# EAGLE design Qwiic_OLED_Breakout (EAGLE 9.6.2)
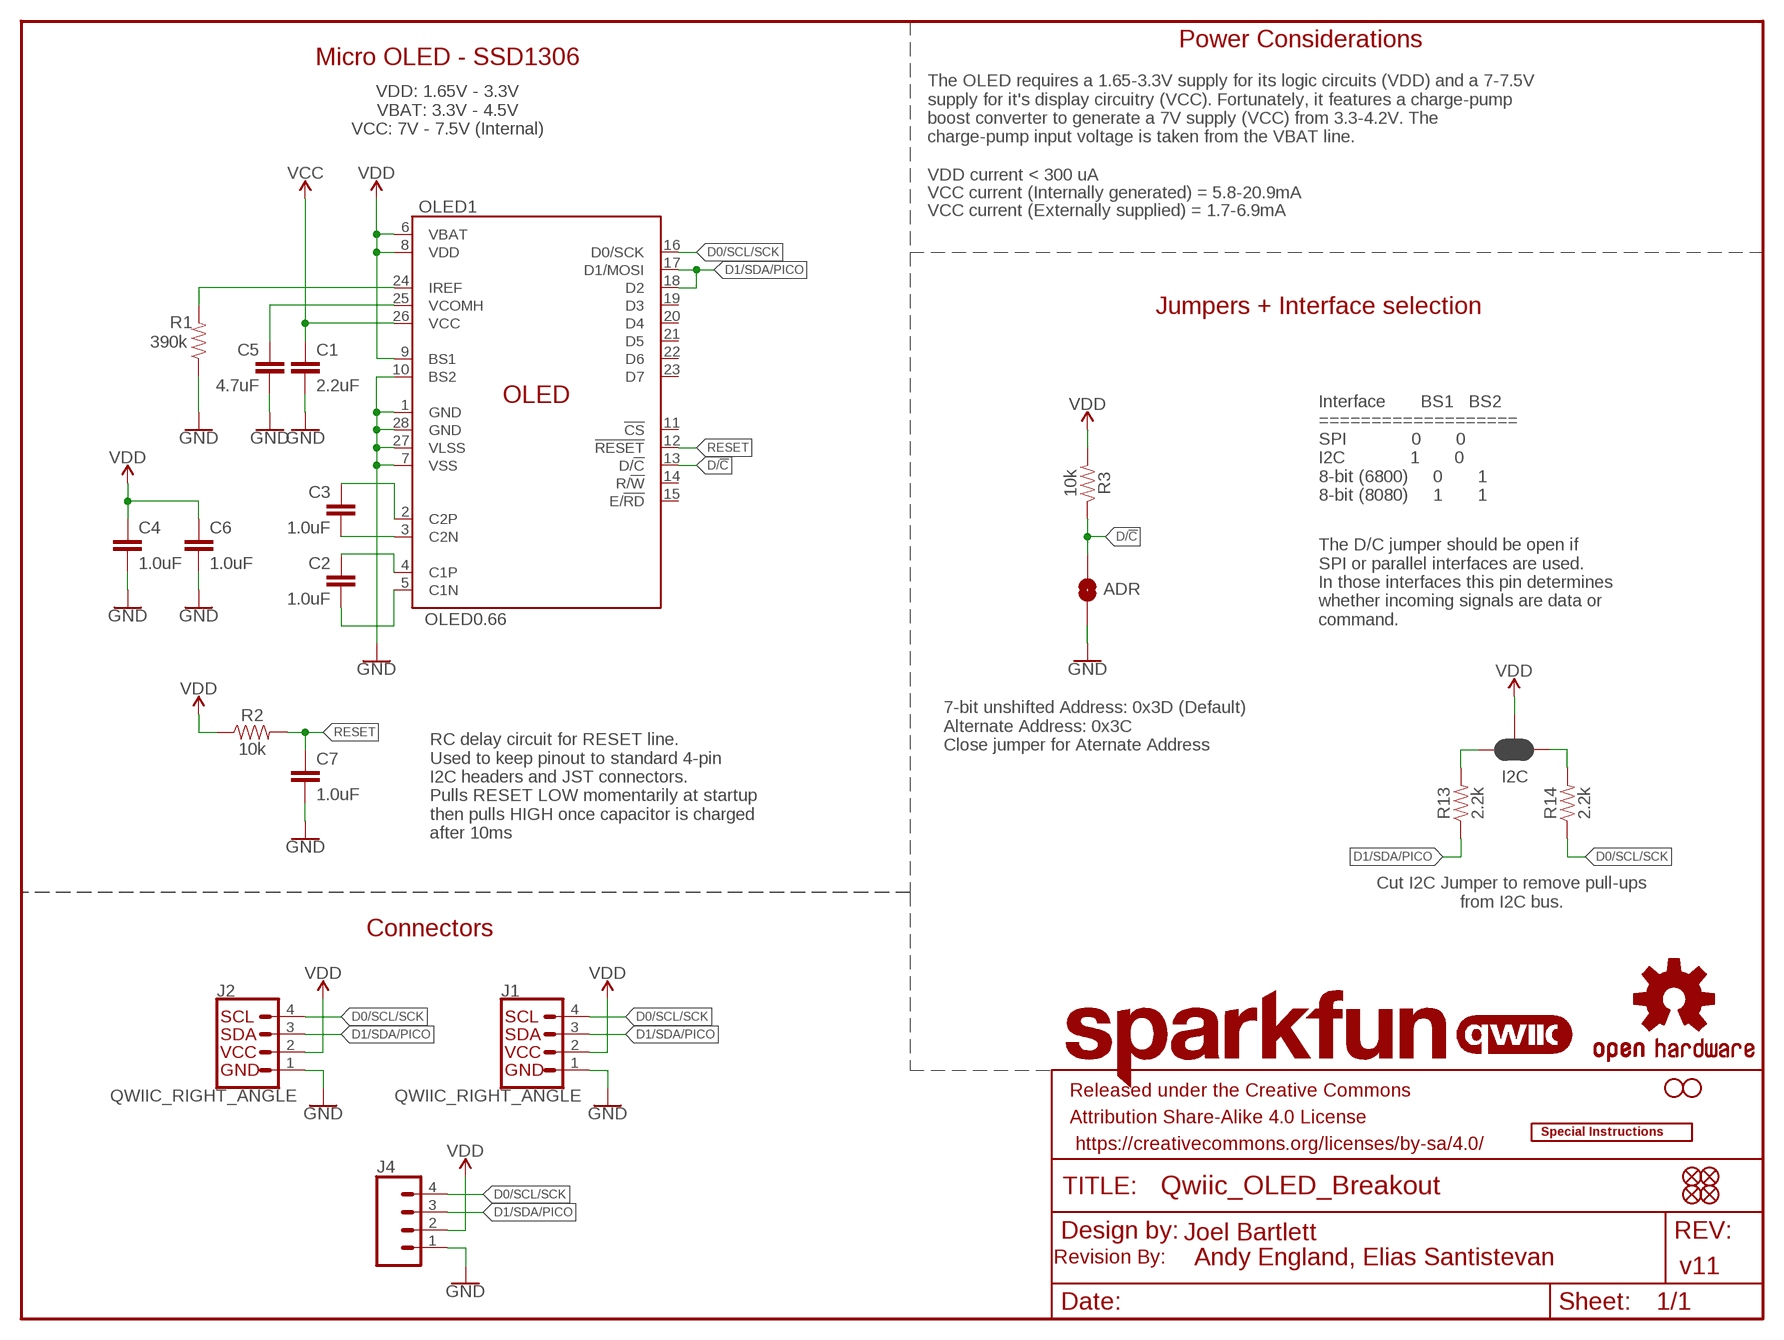
[diagram p0: schematic, sheet 1]

## Parts
ADR  JUMPER-SMT_2_NO_SILK  [SMT-JUMPER_2_NO_SILK]
C1  2.2uF  2.2UF-0805-25V-(+80/-20%)  [0805]
C2  1.0uF  1.0UF-0805-25V-10%  [0805]
C3  1.0uF  1.0UF-0805-25V-10%  [0805]
C4  1.0uF  1.0UF-0603-16V-10%  [0603]
C5  4.7uF  4.7UF-1206-16V-(+80/-20%)  [1206]
C6  1.0uF  1.0UF-0603-16V-10%  [0603]
C7  1.0uF  1.0UF-0603-16V-10%  [0603]
FID1  FIDUCIAL1X2  [FIDUCIAL-1X2]
FID2  FIDUCIAL1X2  [FIDUCIAL-1X2]
FID3  FIDUCIAL1X2  [FIDUCIAL-1X2]
FID4  FIDUCIAL1X2  [FIDUCIAL-1X2]
FRAME1  FRAME-LETTER  [CREATIVE_COMMONS]
H1  STAND-OFF  [STAND-OFF]
H2  STAND-OFF  [STAND-OFF]
I2C  JUMPER-SMT_3_2-NC_PASTE_SILK  [SMT-JUMPER_3_2-NC_PASTE_SILK]
J1  QWIIC_RIGHT_ANGLE  QWIIC_CONNECTORJS-1MM  [JST04_1MM_RA]
J2  QWIIC_RIGHT_ANGLE  QWIIC_CONNECTORJS-1MM  [JST04_1MM_RA]
J4  CONN_041X04_NO_SILK_NO_POP  [1X04_NO_SILK]
LOGO2  SFE_LOGO_NAME.1_INCH  [SFE_LOGO_NAME_.1]
LOGO3  OSHW-LOGOS  [OSHW-LOGO-S]
LOGO5  QWIIC_LOGO_4MM  [QWIIC_4MM]
LOGO6  SPECIAL_INSTRUCTIONS-ORDERING  [ORDERING_INSTRUCTIONS]
OLED1  OLED0.66  [OLED-0.66-64X48]
R1  390k  390KOHM-0603-1/10W-1%  [0603]
R2  10k  10KOHM-0603-1/10W-1%  [0603]
R3  10k  10KOHM-0603-1/10W-1%  [0603]
R13  2.2k  2.2KOHM-0603-1/10W-1%  [0603]
R14  2.2k  2.2KOHM-0603-1/10W-1%  [0603]

## Nets
C1P: C2.1 OLED1.4(C1P)
C2N: C3.2 OLED1.3(C2N)
D0/SCL/SCK: J1.4 J2.4 J4.4 OLED1.16(D0/SCK) R14.1
D1/SDA/PICO: J1.3 J2.3 J4.3 OLED1.17(D1/MOSI) OLED1.18(D2) R13.1
D/!C!: ADR.2 OLED1.13(D/!C!) R3.1
GND: ADR.1 C1.2 C4.2 C5.2 C6.2 C7.2 J1.1 J2.1 J4.1 OLED1.1(GND) OLED1.7(VSS) OLED1.10(BS2) OLED1.27(VLSS) OLED1.28(GND) R1.1
IREF: OLED1.24(IREF) R1.2
N$1: C3.1 OLED1.2(C2P)
N$2: C2.2 OLED1.5(C1N)
N$4: I2C.3 R13.2
N$5: I2C.1 R14.2
RESET: C7.1 OLED1.12(!RESET!) R2.2
VCC: C1.1 OLED1.26(VCC)
VCOMH: C5.1 OLED1.25(VCOMH)
VDD: C4.1 C6.1 I2C.2 J1.2 J2.2 J4.2 OLED1.6(VBAT) OLED1.8(VDD) OLED1.9(BS1) R2.1 R3.2
Unconnected: OLED1.11(!CS!) OLED1.14(R/!W!) OLED1.15(E/!RD!) OLED1.19(D3) OLED1.20(D4) OLED1.21(D5) OLED1.22(D6) OLED1.23(D7)

## Notes on the sheet
- Power Considerations
- Micro OLED - SSD1306
- The OLED requires a 1.65-3.3V supply for its logic circuits (VDD) and a 7-7.5V
  supply for it's display circuitry (VCC). Fortunately, it features a charge-pump 
  boost converter to generate a 7V supply (VCC) from 3.3-4.2V. The 
  charge-pump input voltage is taken from the VBAT line.
- VDD: 1.65V - 3.3V
  VBAT: 3.3V - 4.5V
  VCC: 7V - 7.5V (Internal)
- VDD current < 300 uA
- VCC current (Internally generated) = 5.8-20.9mA
- VCC current (Externally supplied) = 1.7-6.9mA
- Jumpers + Interface selection
- Interface       BS1   BS2
  ===================
  SPI             0       0
  I2C             1       0
  8-bit (6800)     0       1
  8-bit (8080)     1       1
- The D/C jumper should be open if
  SPI or parallel interfaces are used.
  In those interfaces this pin determines
  whether incoming signals are data or
  command.
- 7-bit unshifted Address: 0x3D (Default)
  Alternate Address: 0x3C
  Close jumper for Aternate Address
- RC delay circuit for RESET line. 
  Used to keep pinout to standard 4-pin
  I2C headers and JST connectors. 
  Pulls RESET LOW momentarily at startup
  then pulls HIGH once capacitor is charged
  after 10ms
- Cut I2C Jumper to remove pull-ups 
  from I2C bus.
- Connectors
- Joel Bartlett
- Revision By: | Andy England, Elias Santistevan
- v11

## Library data of the parts
ADR = SparkFun-Jumpers:JUMPER-SMT_2_NO: Normally open jumper This jumper has two pads in close proximity to each other. Apply solder to close the connection. Round pads are easier to solder for beginners, but are a lot larger. SparkFun Product that uses the round pads: SparkFun EL Sequencer <https://www.sparkfun.com/products/12781>
C1 = SparkFun-Capacitors:2.2UF: 2.2µF ceramic capacitors A capacitor is a passive two-terminal electrical component used to store electrical energy temporarily in an electric field.; PROD_ID: CAP-11624
C2 C3 = SparkFun-Capacitors:1.0UF: 1µF ceramic capacitors A capacitor is a passive two-terminal electrical component used to store electrical energy temporarily in an electric field.; PROD_ID: CAP-08064
C4 C6 C7 = SparkFun-Capacitors:1.0UF: 1µF ceramic capacitors A capacitor is a passive two-terminal electrical component used to store electrical energy temporarily in an electric field.; PROD_ID: CAP-00868
C5 = SparkFun-Capacitors:4.7UF: 4.7µF ceramic capacitors A capacitor is a passive two-terminal electrical component used to store electrical energy temporarily in an electric field.; PROD_ID: CAP-10300
FID1-FID4 = SparkFun-Aesthetics:FIDUCIAL: Fiducial Alignment Points Point-of-reference for pick-and-place machines and other optical instruments.
FRAME1 = SparkFun-Aesthetics:FRAME-LETTER: Schematic Frame - Letter Standard 8.5x11 US Letter frame
H1 H2 = SparkFun-Hardware:STAND-OFF: Stand Off Drill holes for mechanically mounting via screws, standoffs, etc. Note: Use the keepout ring to avoid running the screw head into surrounding components. Variant Overviews STAND-OFF - Mechanical footprint for a #4 phillips button head screw. STAND-OFF-TIGHT - Mechanical footprint for a #4 phillips button head screw, Example SparkFun Products Screw - Phillips Head (1/4", 4-40, 10 pack) <https://www.sparkfun.com/products/10453> (PRT-10453) Screw - Phillips Head (1/2", 4-40, 10 pack) <https://www.sparkfun.com/products/10452> (PRT-10452) Screw - Phillips Head (3/4", 4-40, 10 pack) <https://www.sparkfun.com/products/10451> (PRT-10451) Screw - Phillips Head (1", 4-40, 10 pack) <https://www.sparkfun.com/products/10450> (PRT-10450)
I2C = SparkFun-Jumpers:JUMPER-SMT_3_2-NC_PASTE: Normally closed solder jumper (2 of 2 connections) This jumper has an aperture in the stencil to allow solder paste to bridge both connections. Both connections are normally closed (NC). Wick off the solder to open the connection(s). Reapply solder to reclose the connection(s).
J1 J2 = SparkFun-Connectors:QWIIC_CONNECTOR: SparkFun I2C Standard Qwiic Connector An SMD 1mm pitch JST connector makes it easy and quick (get it? Qwiic?) to connect I2C devices to each other. The Qwiic system <http://www.sparkfun.com/qwiic> enables fast and solderless connection between popular platforms and various sensors and actuators. We carry 200mm <https://www.sparkfun.com/products/14204>, 100mm <https://www.sparkfun.com/products/14205>, 50mm <https://www.sparkfun.com/products/14206>, and breadboard friendly <https://www.sparkfun.com/products/14207> Qwiic cables. We also offer 10 pcs strips <https://www.sparkfun.com/products/14323> the SMD connectors.; PROD_ID: CONN-13694
J4 = SparkFun-Connectors:CONN_04: Multi connection point. Often used as Generic Header-pin footprint for 0.1 inch spaced/style header connections On any of the 0.1 inch spaced packages, you can populate with these: Break Away Headers - Straight <https://www.sparkfun.com/products/116> (PRT-00116) Break Away Male Headers - Right Angle <https://www.sparkfun.com/products/553> (PRT-00553) Female Headers <https://www.sparkfun.com/products/115> (PRT-00115) Break Away Headers - Machine Pin <https://www.sparkfun.com/products/117> (PRT-00117) Break Away Female Headers - Swiss Machine Pin <https://www.sparkfun.com/products/743> (PRT-00743) For SCREWTERMINALS and SPRING TERMINALS visit here: Screw Terimnals on SparkFun.com <https://www.sparkfun.com/search/results?term=Screw+Terminals> (5mm/3.5mm/2.54mm spacing) This device is also useful as a general connection point to wire up your design to another part of your project. Our various solder wires solder well into these plated through hole pads. Hook-Up Wire - Assortment (Stranded, 22 AWG) <https://www.sparkfun.com/products/11375> (PRT-11375) Hook-Up Wire - Assortment (Solid Core, 22 AWG) <https://www.sparkfun.com/products/11367> (PRT-11367) View the entire wire category on our website here <https://www.sparkfun.com/categories/141> Special notes: Molex polarized connector foot print use with SKU : PRT-08231 with associated crimp pins and housings. 1MM SMD Version SKU: PRT-10208
LOGO2 = SparkFun-Aesthetics:SFE_LOGO_NAME: SparkFun Font Logo This is the SparkFun name logo. The logo on the schematic will always be the same size; the package variant is the height of the flame part of the logo (or the height the flame would be, if it were drawn). Default layer for the logo on the board is tSilk.
LOGO3 = SparkFun-Aesthetics:OSHW-LOGO: Open-Source Hardware (OSHW) Logo This logo indicates the piece of hardware it is found on incorporates a OSHW license and/or adheres to the definition of open source hardware found here: http://freedomdefined.org/OSHW
LOGO5 = SparkFun-Aesthetics:QWIIC_LOGO: Qwiic Logos for placement on schematic and PCB. The 5.5mm silk logo is best for placing next to Qwiic connector.
LOGO6 = SparkFun-Aesthetics:SPECIAL_INSTRUCTIONS: Special Ordering/Production Instructions Alert Symbol for special PCB ordering instructions or unique production process warnings. Ordering Instructions Production Instructions Types of information that should be added to box: Copper weight Soldermask color Silk color PCB thickness Number of layers PCB Standard: 1.6mm FR4 1 oz copper immersion silver plating red soldermask white silkscreen Types of information that should be added to box: Special wash requirements Depaneling instructions Humidification Glue curing Default text settings: 0.07 inch 9% ratio 50% line distance
OLED1 = SparkFun-Displays:OLED0.66: Micro OLED TODO: Add description SparkFun Products: Micro OLED Breakout <https://www.sparkfun.com/products/13003>; PROD_ID: LCD-12019
R1 = SparkFun-Resistors:390KOHM: 390kΩ resistor A resistor is a passive two-terminal electrical component that implements electrical resistance as a circuit element. Resistors act to reduce current flow, and, at the same time, act to lower voltage levels within circuits. - Wikipedia; PROD_ID: RES-12024
R2 R3 = SparkFun-Resistors:10KOHM: 10kΩ resistor A resistor is a passive two-terminal electrical component that implements electrical resistance as a circuit element. Resistors act to reduce current flow, and, at the same time, act to lower voltage levels within circuits. - Wikipedia; PROD_ID: RES-00824
R13 R14 = SparkFun-Resistors:2.2KOHM: 2.2kΩ resistor A resistor is a passive two-terminal electrical component that implements electrical resistance as a circuit element. Resistors act to reduce current flow, and, at the same time, act to lower voltage levels within circuits. - Wikipedia; PROD_ID: RES-08272

## Board
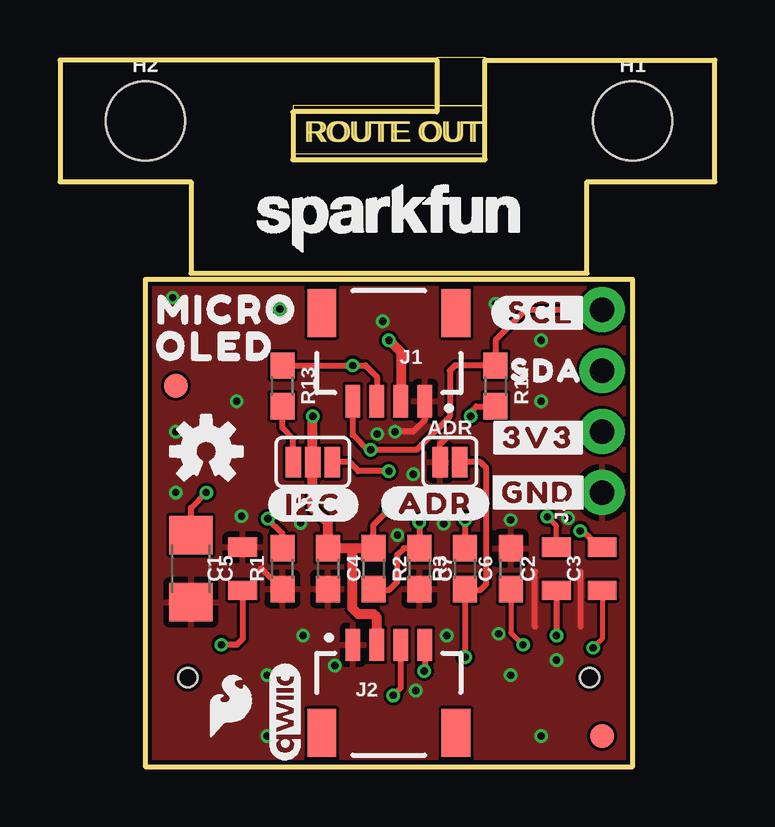
[diagram p1: board, top side]
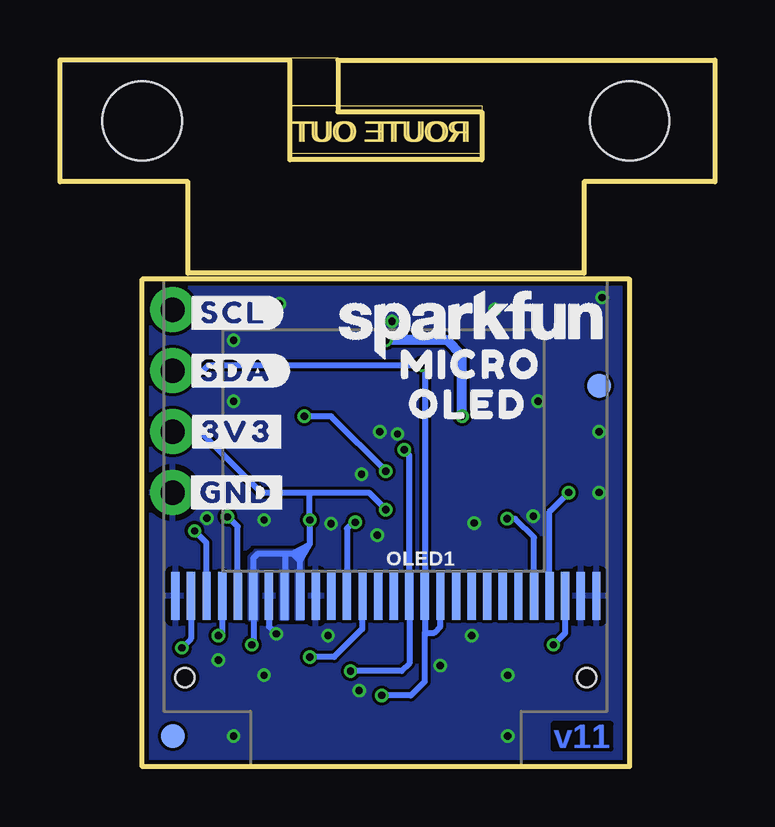
[diagram p2: board, bottom side, seen from below]

Size 27.3 x 29.46 mm. Coordinates in mm from the lower left corner, seen from the top.
Outline: 17.72,25.3 9.72,25.3 9.72,27.3 15.72,27.3 15.72,29.46 0,29.46 0,24.38 5.46,24.38 5.46,20.57 21.97,20.57 21.97,24.38 27.3,24.38 27.3,29.46 17.72,29.46 17.72,25.31
Outline: 23.88,0 23.88,20.32 3.56,20.32 3.56,0 23.88,0
Copper layers (1*16): Top 0.035mm / dielectric 1.5mm / Bottom 0.035mm
Design rules "SparkFun-2-Layer-Minimum-JLCPCB": minimum track width 5mil, minimum drill 0.3mm, track to track 5mil, track to pad 5mil, pad to pad 5mil, via to via 5mil, smd to smd 5mil, copper to edge 7mil, drill to drill 7mil, minimum pad ring 5mil, minimum via ring 5mil, stop-mask expansion 2.5mil, vias tented up to drill 25mil, thermal gap 10mil
Milling: area 9.7,25.6 to 17.7,27.6; area 15.7,27.6 to 17.7,29.6

### Footprints (pad centres in the part's own frame; a part is rotated, then mirrored left to right if it is on the bottom)
SMT-JUMPER_2_NO_SILK = smd 0.635 x 1.27: 1 -0.406,0; 2 0.406,0
0805 = smd 0.8 x 1.2: 1 -0.9,0; 2 0.9,0
0603 = smd 1.1 x 1: 1 -0.85,0; 2 0.85,0
1206 = smd 1.6 x 1.8: 1 -1.4,0; 2 1.4,0
FIDUCIAL-1X2 = smd 1 x 1: 1 0,0
STAND-OFF = hole 3.302: 0,0
SMT-JUMPER_3_2-NC_PASTE_SILK = smd 0.635 x 1.27: 1 -0.813,0; 2 0,0; 3 0.813,0
JST04_1MM_RA = smd 0.6 x 1.35: 1 -1.5,0; 2 -0.5,0; 3 0.5,0; 4 1.5,0 | smd 1.2 x 2: NC1 2.8,-3.675; NC2 -2.8,-3.675
1X04_NO_SILK = drill 1.016 pad 1.88: 1 0,0; 2 2.54,0; 3 5.08,0; 4 7.62,0
OLED-0.66-64X48 = smd 0.35 x 2: 1 -8.775,0; 2 -8.125,0; 3 -7.475,0; 4 -6.825,0; 5 -6.175,0; 6 -5.525,0; 7 -4.875,0; 8 -4.225,0; 9 -3.575,0; 10 -2.925,0; 11 -2.275,0; 12 -1.625,0; 13 -0.975,0; 14 -0.325,0; 15 0.325,0; 16 0.975,0; 17 1.625,0; 18 2.275,0; 19 2.925,0; 20 3.575,0; 21 4.225,0; 22 4.875,0; 23 5.525,0; 24 6.175,0; 25 6.825,0; 26 7.475,0; 27 8.125,0; 28 8.775,0 | hole 0.8: 8.375,-3.4; -8.375,-3.4

### Placement (x,y rotation side)
ADR  16.26,12.7 0 top
C1  7.62,8.26 90 top
C2  20.7,8.26 90 top
C3  22.61,8.26 90 top
C4  11.18,8.26 270 top
C5  5.46,8.26 270 top
C6  18.8,8.26 90 top
C7  14.99,8.26 270 top
FID1  22.61,1.27 0 top
FID2  4.83,15.88 0 top
FID3  4.83,15.88 0 bottom
FID4  22.61,1.27 0 bottom
FRAME1  -14.22,-27.94 0 top  (outside the outline)
H1  23.88,26.92 0 top
H2  3.56,26.92 0 top
I2C  10.54,12.7 180 top
J1  13.72,15.24 180 top
J2  13.72,5.08 0 top
J4  22.61,11.43 90 top
LOGO2  13.72,22.86 0 top
LOGO3  6.1,13.14 0 top
LOGO4  SFE_LOGO_NAME.1_INCH  [SFE_LOGO_NAME_.1]  10.16,18.41 0 bottom
LOGO5  9.4,2.29 90 top
LOGO6  37.85,46.99 0 top  (outside the outline)
OLED1  13.72,7.11 0 bottom
R1  9.27,8.26 90 top
R2  13.08,8.26 270 top
R3  16.89,8.26 90 top
R13  9.27,15.88 270 top
R14  18.16,15.88 270 top
U$1  [MICRO593420]  6.98,19.05 0 top
U$2  [OLED593421]  6.48,17.53 0 top
U$3  [#ADR#5]  15.65,10.97 0 top
U$4  [#SCL#9]  20.07,18.92 0 top
U$5  [#3V3#1]  19.94,13.72 0 top
U$6  [#GND#0]  19.94,11.43 0 top
U$7  [SDA8]  20.32,16.51 0 top
U$8  [#I2C#1348]  10.57,10.92 0 top
U$9  [#SCL#8]  20.07,18.92 0 bottom
U$10  [#SDA#10]  19.94,16.51 0 bottom
U$11  [#3V3#1]  19.94,13.97 0 bottom
U$12  [#GND#0]  19.94,11.43 0 bottom
U$13  [MICRO593420]  10.16,16.76 0 bottom
U$14  [OLED593421]  10.29,15.11 0 bottom
U$15  [SFE_LOGO_FLAME_.1]  7.11,2.54 0 top

### Tracks (layer width: path | path; a pad name or v marks a point on that pad's centre or on a via)
C1P  (via drill 0.3)
  Top 0.254: C2.1 v20.7,5.46
  Bottom 0.254: OLED1.4 20.54,5.62 v20.7,5.46
C2N  (via drill 0.3)
  Top 0.254: v21.69,9.83 21.79,9.83 22.47,9.15 C3.2
  Bottom 0.254: OLED1.3 21.19,9.33 v21.69,9.83
D0/SCL/SCK  (via drill 0.3)
  Top 0.254: J2.4 15.22,4.01 v15.19,3.99 | J1.4 12.22,13.82 12.83,13.21 v12.95,13.21 14.86,13.21 16.26,14.61 16.26,16.51 16.47,16.73 R14.1 18.16,17.78 19.43,19.05 J4.4
  Bottom 0.254: v15.19,3.99 13.06,3.99 12.74,4.3 OLED1.16 12.74,12.99 v12.95,13.21
D1/SDA/PICO  (via drill 0.3)
  Top 0.254: v13.89,2.97 14.22,3.29 J2.3 | R13.1 v12.21,16.73 12.74,16.73 13.22,16.25 J1.3
  Bottom 0.254: v13.89,2.97 12.68,2.97 12.09,3.56 12.09,5.59 | J4.3 21.34,16.51 21.12,16.73 v12.21,16.73 12.09,16.61 OLED1.17 12.09,5.59 | OLED1.18 11.44,5.84 11.7,5.59 12.09,5.59
D/!C!  (via drill 0.3)
  Top 0.254: R3.1 16.93,7.37 | 16.93,7.37 17.53,7.37 17.78,7.62 17.78,12.45 17.53,12.7 ADR.2 | 16.93,7.37 16.89,7.33 v16.89,4.57
  Bottom 0.254: v16.89,4.57 15.88,4.57 14.71,5.74 14.71,7.09 OLED1.13
GND  (via drill 0.3)
  Top 0.254: J1.1 15.22,14.45 14.73,13.97 v13.97,13.97 | ADR.1 15.85,13.44 16.13,13.72 | R1.1 8.42,8.26 8.38,8.26 | 21.72,5.84 21.72,8.13 | 19.81,5.84 19.81,8.13
  Bottom 0.254: OLED1.7 18.59,5.84 v18.29,5.54
  other vias: 8.64,3.81 14.73,12.19 20.07,15.24 13.46,18.57 20.07,17.78 18.8,3.81 7.37,15.24 16.13,5.46 18.8,10.29 16,10.13 10.03,10.16 7.57,10.44 20.7,4.45 14.83,3.17 4.7,19.56 4.83,13.97 4.83,11.43 20.07,1.27 8.64,1.27 18.16,19.3 9.17,19.08 10.13,5.46 11.46,4.22 14.07,9.65 21.18,10.36 13.23,13.87
  pour Bottom (rank 3): 23.88,0 23.88,20.32 3.56,20.32 3.56,0
  pour Top (rank 3): 23.88,0 23.88,20.32 3.56,20.32 3.56,0
IREF  (via drill 0.3)
  Top 0.254: R1.2 9.27,9.73 v8.66,10.34
  Bottom 0.254: OLED1.24 7.54,9.55 8.33,10.34 v8.66,10.34
N$1  (via drill 0.3)
  Top 0.203: C3.1 22.61,5.33 v22.23,4.95
  Bottom 0.254: v22.23,4.95 21.84,5.34 OLED1.2
N$2  (via drill 0.3)
  Top 0.203: C2.2 20.7,10.03 v20.32,10.41
  Bottom 0.254: OLED1.5 19.89,10.01 20.3,10.41 v20.32,10.41
N$4
  Top 0.254: R13.2 9.27,14.12 9.73,13.66 I2C.3
N$5  (via drill 0.3)
  Top 0.254: v13.72,12.32 12.45,12.32 12.07,12.7 I2C.1 | v17.12,14.61 17.12,14.78 17.36,15.03 R14.2
  Bottom 0.254: v13.72,12.32 16,14.61 v17.12,14.61
RESET  (via drill 0.3)
  Top 0.254: R2.2 13.12,7.37 13.72,7.37 14.07,7.72 14.07,8.84 14.34,9.11 C7.1 v14.99,10.19
  Bottom 0.254: v14.99,10.19 15.09,10.19 15.34,9.93 OLED1.12
VCC  (via drill 0.3)
  Top 0.254: C1.1 7.62,5.33 7.37,5.08 v6.73,5.08
  Bottom 0.254: v6.73,5.08 6.24,5.57 OLED1.26
VCOMH  (via drill 0.3)
  Top 0.254: C5.1 5.46,10.79 v6.1,11.43
  Bottom 0.254: v6.1,11.43 6.79,10.73 6.89,10.63 OLED1.25
VDD  (via drill 0.3)
  Top 0.203: C6.1 18.8,5.59 v19.3,5.08
  Top 0.254: 12.19,9.11 R2.1 13.08,10.08 v13.72,10.72 | v16.89,10.29 R3.2
  Top 0.406: J2.2 13.22,6.21 13.08,6.35 12.45,6.35 12.19,6.6 12.19,9.11 | R2.1 C4.1 11.18,10.16 10.54,10.79 I2C.2 v10.54,14.61 | v13.72,17.78 14.22,17.28 J1.2
  Bottom 0.254: 16.89,11.43 18.92,11.43 21.46,13.97 J4.2 | 16.89,11.43 14.43,11.43 v13.72,10.72 | OLED1.9 17.29,8.58 | 16.89,11.43 v16.89,10.29 16.89,9.27 | 17.29,8.58 17.44,8.73 | 17.6,8.89 17.44,8.73 | 16.89,9.27 17.44,8.73 | 17.91,8.89 19.05,8.89 19.24,8.7 OLED1.6 19.24,5.14 v19.3,5.08 | 17.91,8.89 17.6,8.89 | OLED1.8 17.91,7.15 17.91,8.89 | 16.89,9.27 17.29,8.58 | 16.89,9.27 17.6,8.89
  Bottom 0.406: v10.54,14.61 10.54,17.14 11.18,17.78 v13.72,17.78
  pour Bottom (no thermals): 17.48,6.15 17.14,6.15 17.14,8.64 17.53,9.02 19.18,9.02 19.43,8.76 19.43,6.12 19.05,6.12 19.05,8.33 18.14,8.33 18.14,6.15 17.78,6.15 17.78,8.31 17.48,8.31

### Text on the board
Bottom: v11
Milling: ROUTE OUT | ROUTE OUT
Measures: Units in Inches
tDocu: Two Layer Board | Red Soldermask | White Silkscreen | 1.6mm Thickness | Lead-Free HASL | Joel Bartlett | Revised By: | Andy England, Elias Santistevan